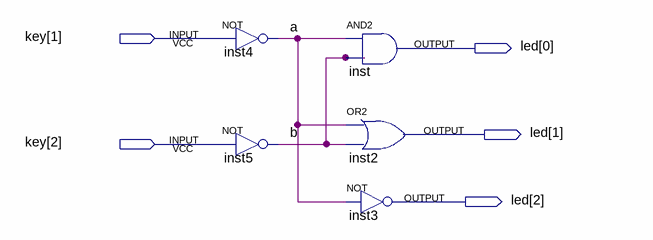
[diagram p0: schematic sheet]
// Quartus schematic lab1.bdf as structural Verilog: 5 symbols, 5 pins
module lab1 (
  input  [2:1] key,
  output [2:0] led
);

  wire a, b;

  not inst4 (a, key[1]);
  not inst5 (b, key[2]);
  // AND2 inst has open pins: IN1=a, IN2=b, OUT=open
  or inst2 (led[1], a, b);
  not inst3 (led[2], a);
endmodule
